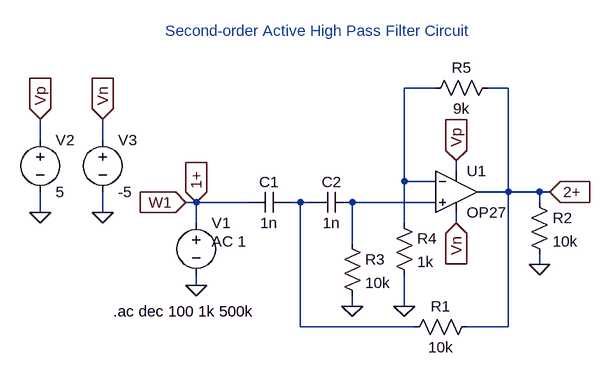
[diagram p0: schematic ahpf_gain_2nd.asc]
ahpf_gain_2nd.asc, the LTspice schematic file:
Version 4
SHEET 1 880 680
WIRE 496 32 448 32
WIRE 608 32 576 32
WIRE -112 112 -112 80
WIRE -16 112 -16 80
WIRE 528 160 528 144
WIRE 448 176 448 32
WIRE 496 176 448 176
WIRE 608 192 608 32
WIRE 608 192 560 192
WIRE 656 192 608 192
WIRE 672 192 656 192
WIRE 128 208 112 208
WIRE 208 208 128 208
WIRE 288 208 272 208
WIRE 304 208 288 208
WIRE 496 208 368 208
WIRE 656 208 656 192
WIRE -112 224 -112 192
WIRE -16 224 -16 192
WIRE 128 240 128 208
WIRE 448 240 448 176
WIRE 528 240 528 224
WIRE 368 272 368 208
WIRE 656 304 656 288
WIRE 128 336 128 320
WIRE 368 368 368 352
WIRE 448 368 448 320
WIRE 288 400 288 208
WIRE 464 400 288 400
WIRE 608 400 608 192
WIRE 608 400 544 400
FLAG 128 336 0
FLAG -112 224 0
FLAG -16 224 0
FLAG -112 80 Vp
IOPIN -112 80 In
FLAG -16 80 Vn
IOPIN -16 80 In
FLAG 528 144 Vp
IOPIN 528 144 In
FLAG 528 240 Vn
IOPIN 528 240 In
FLAG 656 304 0
FLAG 672 192 2+
IOPIN 672 192 In
FLAG 112 208 W1
IOPIN 112 208 In
FLAG 128 208 1+
IOPIN 128 208 In
FLAG 368 368 0
FLAG 448 368 0
SYMBOL Opamps\\OP27 528 128 R0
SYMATTR InstName U1
SYMBOL cap 272 192 R90
WINDOW 0 0 32 VBottom 2
WINDOW 3 32 32 VTop 2
SYMATTR InstName C1
SYMATTR Value 1n
SYMBOL res 560 384 R90
WINDOW 0 0 56 VBottom 2
WINDOW 3 32 56 VTop 2
SYMATTR InstName R1
SYMATTR Value 10k
SYMBOL voltage 128 224 R0
WINDOW 123 24 44 Left 2
WINDOW 39 0 0 Left 0
SYMATTR Value2 AC 1
SYMATTR InstName V1
SYMATTR Value ""
SYMBOL voltage -112 96 R0
WINDOW 123 0 0 Left 0
WINDOW 39 0 0 Left 0
SYMATTR InstName V2
SYMATTR Value 5
SYMBOL voltage -16 96 R0
WINDOW 123 0 0 Left 0
WINDOW 39 0 0 Left 0
SYMATTR InstName V3
SYMATTR Value -5
SYMBOL res 640 192 R0
SYMATTR InstName R2
SYMATTR Value 10k
SYMBOL cap 368 192 R90
WINDOW 0 0 32 VBottom 2
WINDOW 3 32 32 VTop 2
SYMATTR InstName C2
SYMATTR Value 1n
SYMBOL res 352 256 R0
SYMATTR InstName R3
SYMATTR Value 10k
SYMBOL res 432 224 R0
SYMATTR InstName R4
SYMATTR Value 1k
SYMBOL res 592 16 R90
WINDOW 0 0 56 VBottom 2
WINDOW 3 32 56 VTop 2
SYMATTR InstName R5
SYMATTR Value 9k
TEXT 0 376 Left 2 !.ac dec 100 1k 500k
TEXT 80 -56 Left 2 ;Second-order Active High Pass Filter Circuit

The netlist it stands for:
* ahpf_gain_2nd.asc
XU1 N003 N001 Vp Vn 2+ OP27  ; pins In+ In- V+ V- OUT
C1 N002 1+ 1n
R1 2+ N002 10k
V1 1+ 0 AC 1
V2 Vp 0 5
V3 Vn 0 -5
R2 2+ 0 10k
C2 N003 N002 1n
R3 N003 0 10k
R4 N001 0 1k
R5 2+ N001 9k
.ac dec 100 1k 500k
* Second-order Active High Pass Filter Circuit
.lib ADI.lib
.backanno
.end